# EAGLE design TriacSwitch (EAGLE 6.1)
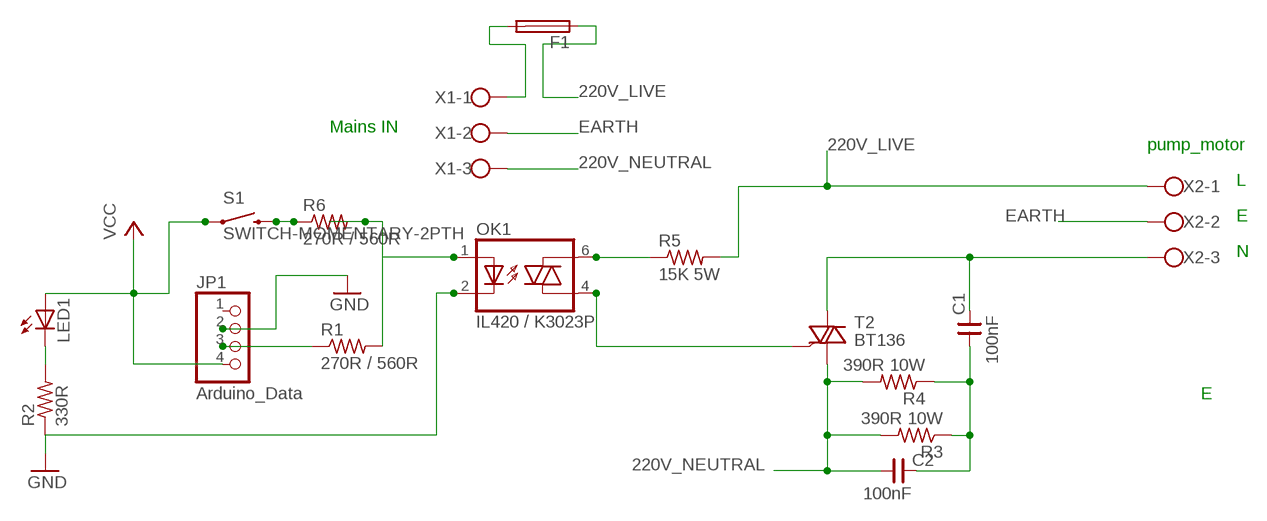
[diagram p0: schematic, sheet 1]

## Parts
C1  100nF  CNP-C050-110X055  [C050-110X055]
C2  100nF  CNP-C050-110X055  [C050-110X055]
F1  KS10H  [KS10H]
JP1  Arduino_Data  PINHD-1X4  [1X04]
LED1  LED3MM  [LED3MM]
OK1  IL420 / K3023P  IL420  [DIL06]
R1  270R / 560R  R-US_0207/10  [0207/10]
R2  330R  R-US_0207/10  [0207/10]
R3  390R 10W  R-US_0922/22  [0922/22]
R4  390R 10W  R-US_0922/22  [0922/22]
R5  15K 5W  R-US_0617/17  [0617/17]
R6  270R / 560R  R-US_0207/10  [0207/10]
S1  SWITCH-MOMENTARY-2PTH  [TACTILE-PTH]
T2  BT136  [TO220AB]
X1  W237-103  [W237-103]
X2  W237-103  [W237-103]

## Nets
220V_LIVE: F1.1 R5.2 X2.1
220V_NEUTRAL: C2.1 R3.2 R4.2 T2.1(A1) X1.3
EARTH: X1.2 X2.2
GND: JP1.2 OK1.2(C) R2.1
N$1: OK1.4(A1) T2.3(G)
N$2: F1.2 X1.1
N$3: JP1.3 R1.1
N$4: LED1.K(C) R2.2
N$5: R6.1 S1.3
N$6: OK1.6(A2) R5.1
N$7: C1.1 C2.2 R3.1 R4.1
N$8: OK1.1(A) R1.2 R6.2
N$11: C1.2 T2.2(A2) X2.3
VCC: JP1.4 LED1.A S1.1
Unconnected: JP1.1

## Notes on the sheet
- Mains IN
- pump_motor
- L
- E
- N
- E

## Library data of the parts
C1 C2 = cap-master:CNP-: NON-POLARIZED CAP
F1 = fuse:KS10H: FUSE HOLDER CS, Schukat; OC_FARNELL: unknown; OC_NEWARK: unknown
JP1 = pinhead:PINHD-1X4: PIN HEADER
LED1 = led:LED: LED OSRAM: - CHIPLED LG R971, LG N971, LY N971, LG Q971, LY Q971, LO R971, LY R971 LH N974, LH R974 LS Q976, LO Q976, LY Q976 LO Q996 - Hyper CHIPLED LW Q18S LB Q993, LB Q99A, LB R99A - SideLED LS A670, LO A670, LY A670, LG A670, LP A670 LB A673, LV A673, LT A673, LW A673 LH A674 LY A675 LS A676, LA A676, LO A676, LY A676, LW A676 LS A679, LY A679, LG A679 - Hyper Micro SIDELED® LS Y876, LA Y876, LO Y876, LY Y876 LT Y87S - SmartLED LW L88C, LW L88S LB L89C, LB L89S, LG L890 LS L89K, LO L89K, LY L89K LS L896, LA L896, LO L896, LY L896 - TOPLED LS T670, LO T670, LY T670, LG T670, LP T670 LSG T670, LSP T670, LSY T670, LOP T670, LYG T670 LG T671, LOG T671, LSG T671 LB T673, LV T673, LT T673, LW T673 LH T674 LS T676, LA T676, LO T676, LY T676, LB T676, LH T676, LSB T676, LW T676 LB T67C, LV T67C, LT T67C, LS T67K, LO T67K, LY T67K, LW E67C LS E67B, LA E67B, LO E67B, LY E67B, LB E67C, LV E67C, LT E67C LW T67C LS T679, LY T679, LG T679 LS T770, LO T770, LY T770, LG T770, LP T770 LB T773, LV T773, LT T773, LW T773 LH T774 LS E675, LA E675, LY E675, LS T675 LS T776, LA T776, LO T776, LY T776, LB T776 LHGB T686 LT T68C, LB T68C - Hyper Mini TOPLED® LB M676 - Mini TOPLED Santana® LG M470 LS M47K, LO M47K, LY M47K Source: http://www.osram.convergy.de LUXEON: - LUMILED® LXK2-PW12-R00, LXK2-PW12-S00, LXK2-PW14-U00, LXK2-PW14-V00 LXK2-PM12-R00, LXK2-PM12-S00, LXK2-PM14-U00 LXK2-PE12-Q00, LXK2-PE12-R00, LXK2-PE12-S00, LXK2-PE14-T00, LXK2-PE14-U00 LXK2-PB12-K00, LXK2-PB12-L00, LXK2-PB12-M00, LXK2-PB14-N00, LXK2-PB14-P00, LXK2-PB14-Q00 LXK2-PR12-L00, LXK2-PR12-M00, LXK2-PR14-Q00, LXK2-PR14-R00 LXK2-PD12-Q00, LXK2-PD12-R00, LXK2-PD12-S00 LXK2-PH12-R00, LXK2-PH12-S00 LXK2-PL12-P00, LXK2-PL12-Q00, LXK2-PL12-R00 Source: www.luxeon.com KINGBRIGHT: KA-3528ASYC Source: www.kingbright.com
OK1 = optocoupler:IL420: SIEMENS OPTO COUPLER; MF: VISHAY/TELEFUNKEN; MPN: IL420; OC_FARNELL: 1469561; OC_NEWARK: 58K1719
R1-R6 = resistor:R-US_: RESISTOR, American symbol
S1 = SparkFun-Electromechanical:SWITCH-MOMENTARY-2: Various NO switches- pushbuttons, reed, etc
T2 = triac:BT136: Triac BT136 series E sensitive gate Source: http://www.nxp.com/acrobat_download/datasheets/BT136_SERIES_E_2.pdf
X1 X2 = con-wago-500:W237-103: WAGO SCREW CLAMP; MPN: 237-103; OC_FARNELL: unknown; OC_NEWARK: 18M7116

## Board
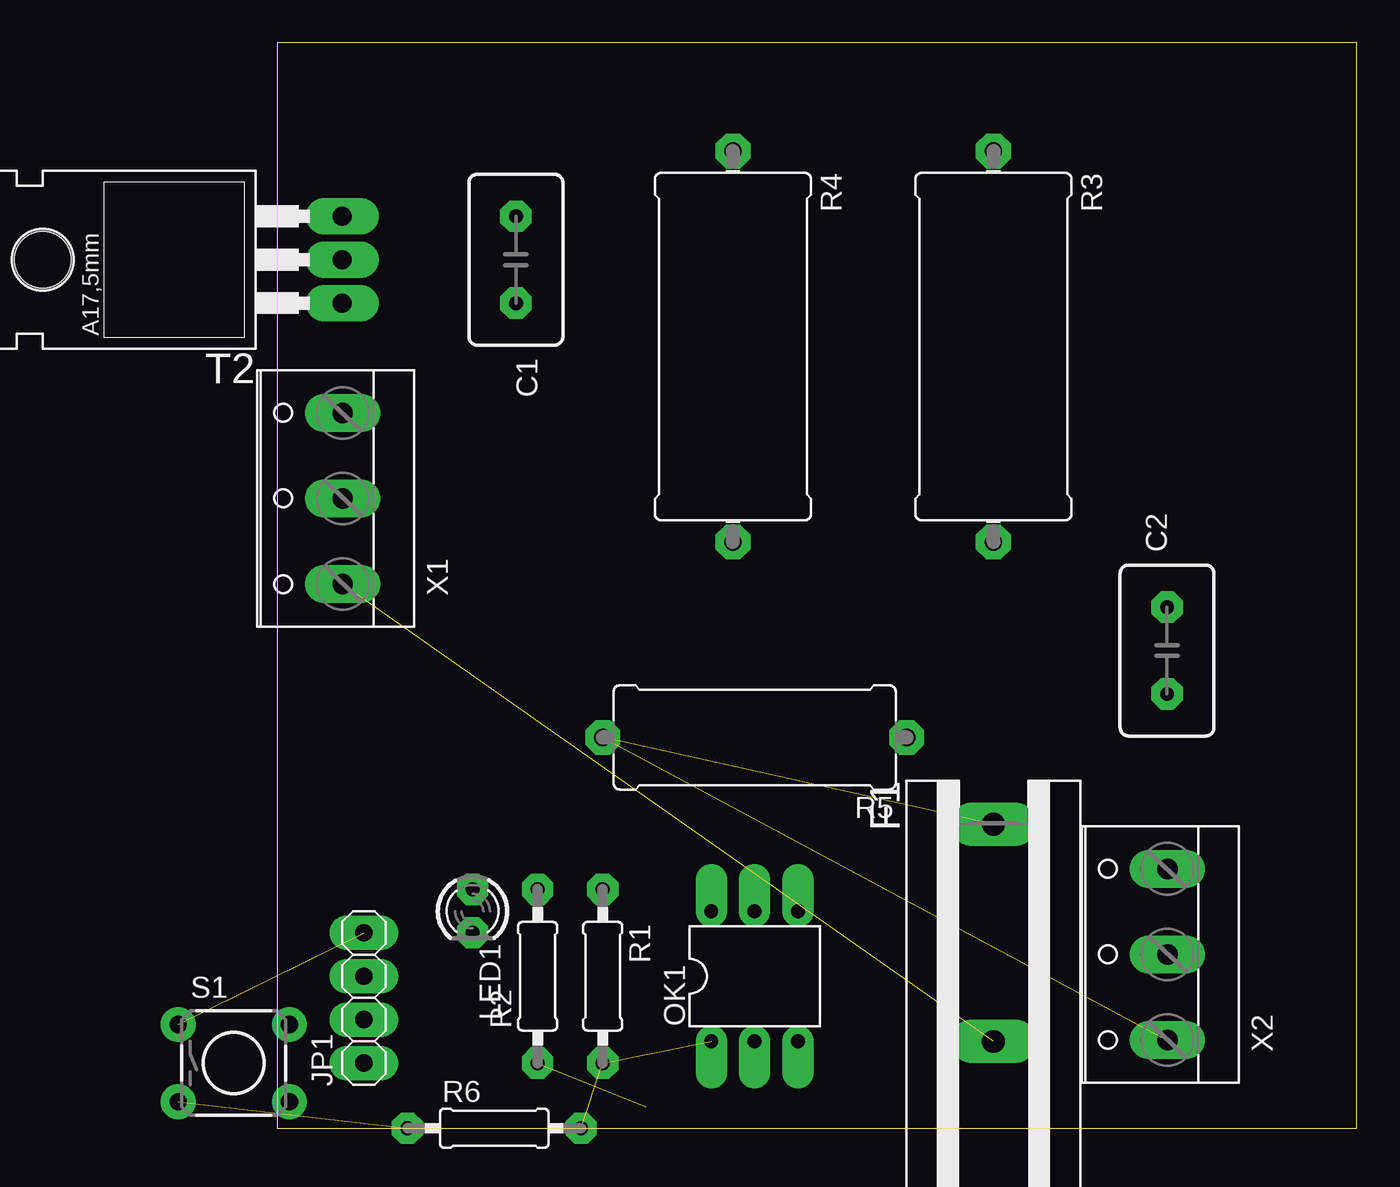
[diagram p1: board, top side]
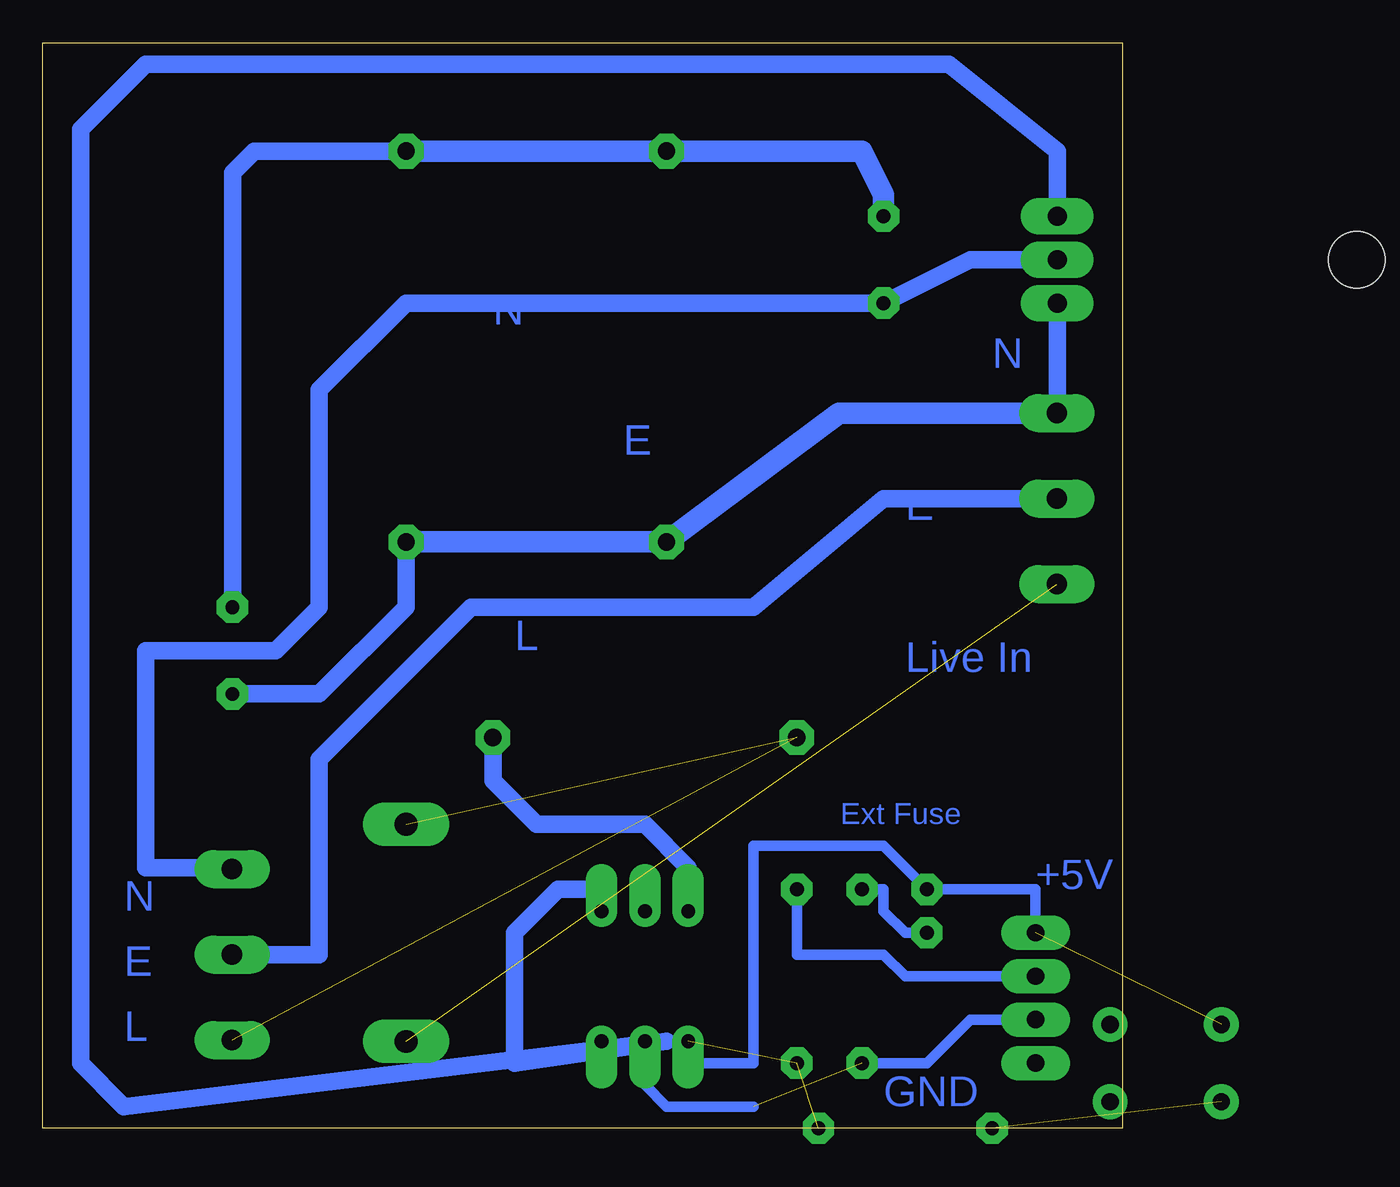
[diagram p2: board, bottom side, seen from below]

Size 63.17 x 63.49 mm. Coordinates in mm from the lower left corner, seen from the top.
Outline: 0,0 63.17,0 63.17,63.49 0,63.49 0,0
Copper layers (1*16): Top 0.035mm / dielectric 1.5mm / Bottom 0.035mm
Design rules: minimum track width 10mil, minimum drill 24mil, track to track 8mil, track to pad 8mil, pad to pad 8mil, via to via 8mil, smd to smd 8mil, copper to edge 40mil, drill to drill 8mil, minimum pad ring 25mil, minimum via ring 25mil, stop-mask expansion 4mil, vias tented up to drill 0mil, thermal gap 10mil

### Footprints (pad centres in the part's own frame; a part is rotated, then mirrored left to right if it is on the bottom)
C050-110X055 = drill 0.813 pad 1.676 octagon: 1 -2.54,0; 2 2.54,0
KS10H = drill 1.321 pad 2.54 long: 1 0,-5.08; 2 0,7.62
1X04 = drill 1.016 long: 1 -3.81,0; 2 -1.27,0; 3 1.27,0; 4 3.81,0
LED3MM = drill 0.813 octagon: A -1.27,0; K 1.27,0
DIL06 = drill 0.813 offset: 1 -2.54,-3.81; 2 0,-3.81; 3 2.54,-3.81; 4 2.54,3.81; 5 0,3.81; 6 -2.54,3.81
0207/10 = drill 0.813 octagon: 1 -5.08,0; 2 5.08,0
0922/22 = drill 1.016 octagon: 1 -11.43,0; 2 11.43,0
0617/17 = drill 1.016 octagon: 1 -8.89,0; 2 8.89,0
TACTILE-PTH = drill 1.016 pad 1.88: 1 -3.251,2.261; 2 3.251,2.261; 3 -3.251,-2.261; 4 3.251,-2.261
TO220AB = drill 1.118 long: 1 -2.54,-6.35; 2 0,-6.35; 3 2.54,-6.35 | hole 3.302: 0,11.176
W237-103 = drill 1.194 long: 1 -5,-1.29; 2 0,-1.29; 3 5,-1.29

### Placement (x,y rotation side)
C1  13.97,50.8 270 top
C2  52.07,27.94 90 top
F1  41.91,12.7 180 top
JP1  5.08,7.62 90 top
LED1  11.43,12.7 270 top
OK1  27.94,8.89 0 top
R1  19.05,8.89 270 top
R2  15.24,8.89 90 top
R3  41.91,45.72 270 top
R4  26.67,45.72 270 top
R5  27.94,22.86 180 top
R6  12.7,0 0 top
S1  -2.54,3.81 0 top
T2  -2.54,50.8 90 top
X1  2.54,36.83 90 top
X2  50.8,10.16 90 top

### Tracks (layer width: path | path; a pad name or v marks a point on that pad's centre or on a via)
220V_LIVE  (2 unrouted)
220V_NEUTRAL
  Bottom 0.61: 3.81,41.85 X1.3
  Bottom 1.016: T2.1 3.81,41.85 | R3.2 41.91,30.48 46.99,25.4 C2.1
  Bottom 1.27: X1.3 16.59,41.83 R4.2 R3.2
EARTH
  Bottom 1.016: X1.2 13.97,36.83 21.59,30.48 38.1,30.48 46.99,21.59 46.99,10.16 X2.2
GND  (1 unrouted)
  Bottom 0.254: 27.94,2.54 OK1.2
  Bottom 0.61: JP1.2 8.89,6.35 11.43,3.81 R2.1 | 21.59,1.27 26.67,1.27 27.94,2.54
N$1
  Bottom 0.254: 30.48,13.97 OK1.4
  Bottom 1.016: T2.3 3.81,57.15 10.16,62.23 57.15,62.23 60.96,58.42 60.96,3.81 58.42,1.27 26.67,5.08 35.56,3.81 35.56,11.43 33.02,13.97 30.48,13.97
N$2  (1 unrouted)
N$3
  Bottom 0.61: R1.1 19.05,10.16 13.97,10.16 12.7,8.89 JP1.3
N$4
  Bottom 0.61: LED1.K 12.7,11.43 13.97,12.7 13.97,13.97 R2.2
N$5  (1 unrouted)
N$6
  Bottom 0.254: OK1.6 25.4,15.24
  Bottom 1.016: 25.4,15.24 27.94,17.78 34.29,17.78 36.83,20.32 R5.1
N$7
  Bottom 1.016: R3.1 50.8,57.15 52.07,55.88 C2.2
  Bottom 1.27: C1.1 13.97,54.61 15.24,57.15 R4.1 R3.1
N$8  (2 unrouted)
N$11
  Bottom 1.016: T2.2 8.89,50.8 C1.2 41.91,48.26 46.99,43.18 46.99,30.48 49.53,27.94 57.15,27.94 57.15,15.24 52.17,15.24 X2.3
VCC  (1 unrouted)
  Bottom 0.61: JP1.4 5.08,13.97 LED1.A 13.97,16.51 21.59,16.51 21.59,3.81 25.4,3.81

### Text on the board
Bottom: N | N | N | E | E | L | Live In | Ext Fuse | +5V | N | E | L | GND